# Altium schematic sheet loom-dash-box.SchDoc
size 420 x 297 mm
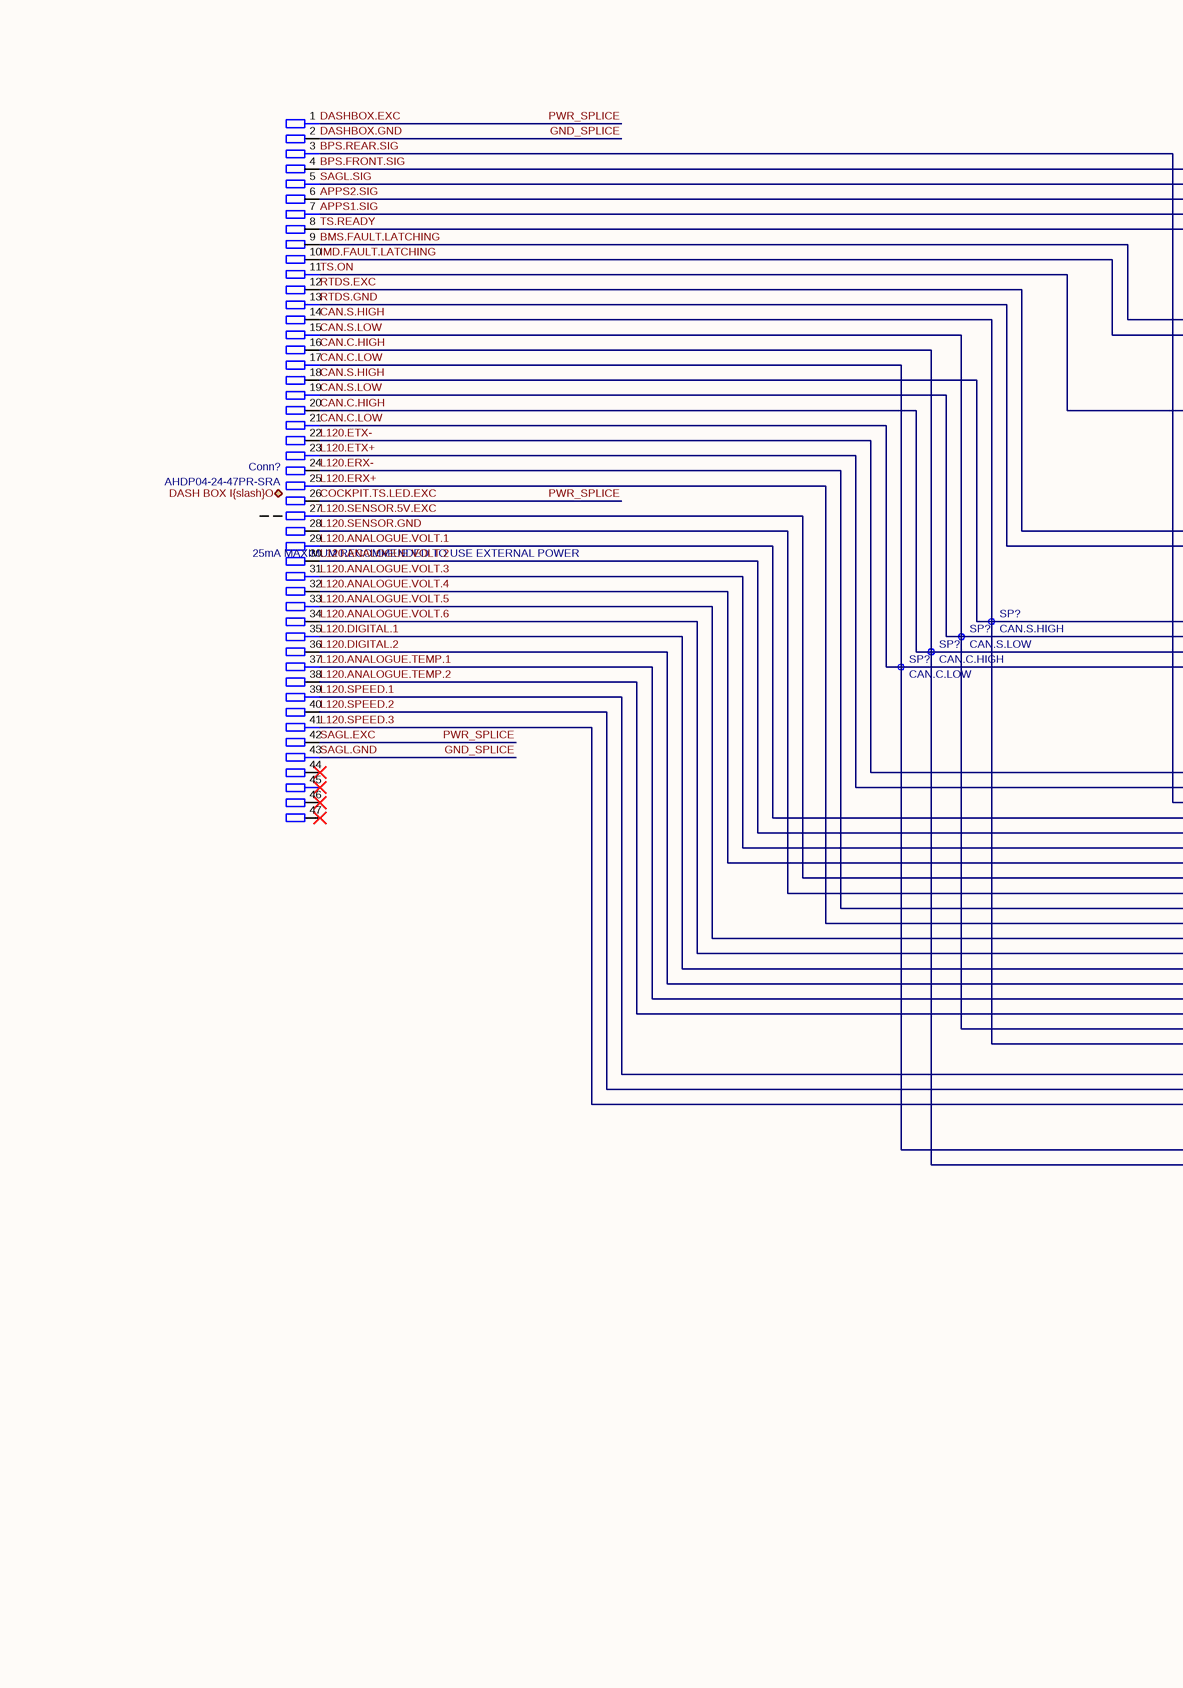
[diagram p0: loom-dash-box.SchDoc, left]
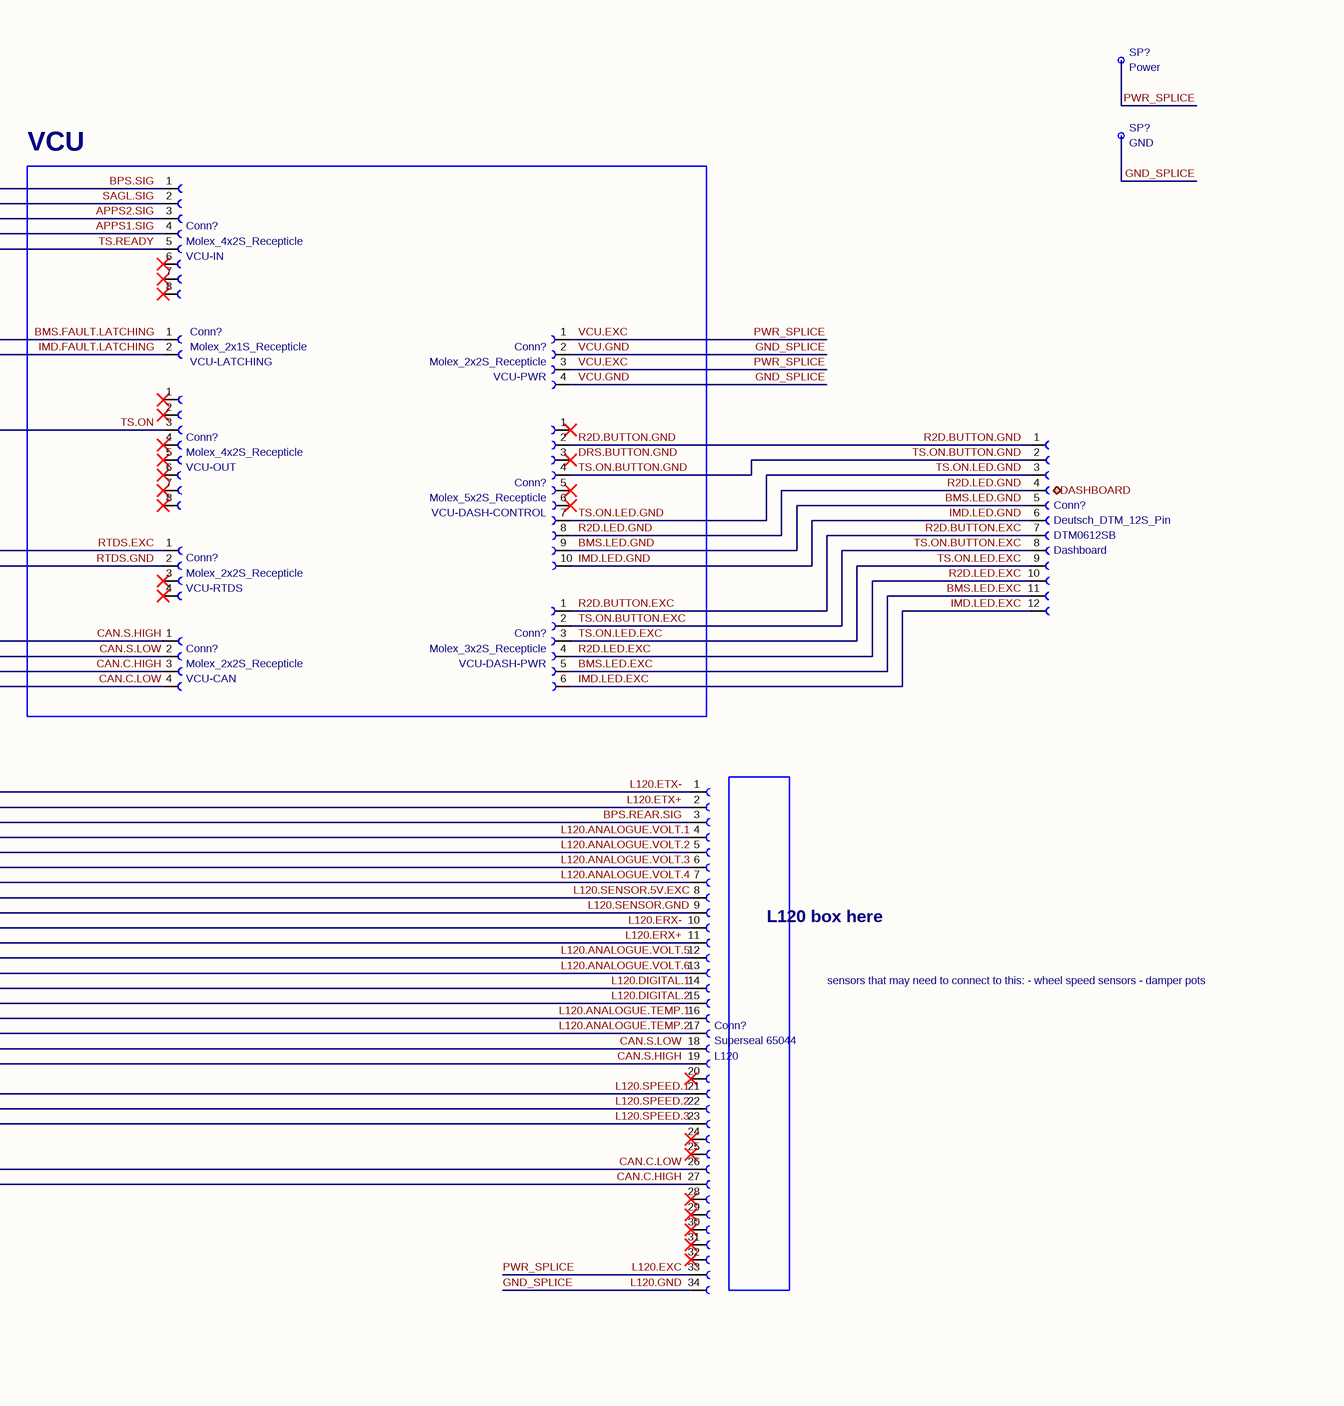
[diagram p1: loom-dash-box.SchDoc, right]

## Parts
(Parts that share a designator on the sheet are numbered #1, #2 ... from top to bottom, then left to right.)
Conn?#1  P/N: AHDP04-24-47PR-SRA  (hidden comment: AMPHENOL-47P-Pannel)
Conn?#2  Conn Name: VCU-IN  (hidden comment: Molex_4x2S_Recepticle)
Conn?#3  Conn Name: VCU-PWR  (hidden comment: Molex_2x2S_Recepticle)
Conn?#4  Conn Name: VCU-LATCHING  (hidden comment: Molex_2x1S_Recepticle)
Conn?#5  Conn Name: VCU-OUT  (hidden comment: Molex_4x2S_Recepticle)
Conn?#6  Conn Name: VCU-DASH-CONTROL  (hidden comment: Molex_5x2S_Recepticle)
Conn?#7  Conn Name: VCU-RTDS  (hidden comment: Molex_2x2S_Recepticle)
Conn?#8  Conn Name: VCU-DASH-PWR  (hidden comment: Molex_3x2S_Recepticle)
Conn?#9  Conn Name: VCU-CAN  (hidden comment: Molex_2x2S_Recepticle)
Conn?#10  P/N: DTM0612SB  Conn Name: Dashboard  (hidden comment: Deutsch_DTM_12S_Pin)
Conn?#11  P/N: Superseal 65044  Conn Name: L120  (hidden comment: L120 Connector)
SP?#1  Power
SP?#2  GND
SP?#3  CAN.S.HIGH
SP?#4  CAN.S.LOW
SP?#5  CAN.C.HIGH
SP?#6  CAN.C.LOW

## Blocks framed on the sheet
VCU: Conn?#2-Conn?#9

## Ports
DASH BOX I{slash}O (bidir), DASHBOARD (bidir)

## Nets
APPS1.SIG: Conn?#1.7 Conn?#2.4
APPS2.SIG: Conn?#1.6 Conn?#2.3
BMS.FAULT.LATCHING: Conn?#1.9 Conn?#4.1
BMS.LED.EXC: Conn?#8.5 Conn?#10.11
BMS.LED.GND: Conn?#6.9 Conn?#10.5
BPS.FRONT.SIG: Conn?#1.4 Conn?#2.1  [also labelled BPS.SIG]
BPS.REAR.SIG: Conn?#1.3 Conn?#11.3
CAN.C.HIGH: Conn?#1.16 Conn?#1.20 Conn?#9.3 Conn?#11.27 SP?#5.1
CAN.C.LOW: Conn?#1.17 Conn?#1.21 Conn?#9.4 Conn?#11.26 SP?#6.1
CAN.S.HIGH: Conn?#1.14 Conn?#1.18 Conn?#9.1 Conn?#11.19 SP?#3.1
CAN.S.LOW: Conn?#1.15 Conn?#1.19 Conn?#9.2 Conn?#11.18 SP?#4.1
COCKPIT.TS.LED.EXC: Conn?#1.1 Conn?#1.26 Conn?#1.42 Conn?#3.1 Conn?#3.3 Conn?#11.33 SP?#1.1  [also labelled DASHBOX.EXC, L120.EXC, PWR_SPLICE, SAGL.EXC, VCU.EXC]
DASHBOX.GND: Conn?#1.2 Conn?#1.43 Conn?#3.2 Conn?#3.4 Conn?#11.34 SP?#2.1  [also labelled GND_SPLICE, L120.GND, SAGL.GND, VCU.GND]
IMD.FAULT.LATCHING: Conn?#1.10 Conn?#4.2
IMD.LED.EXC: Conn?#8.6 Conn?#10.12
IMD.LED.GND: Conn?#6.10 Conn?#10.6
L120.ANALOGUE.TEMP.1: Conn?#1.37 Conn?#11.16
L120.ANALOGUE.TEMP.2: Conn?#1.38 Conn?#11.17
L120.ANALOGUE.VOLT.1: Conn?#1.29 Conn?#11.4
L120.ANALOGUE.VOLT.2: Conn?#1.30 Conn?#11.5
L120.ANALOGUE.VOLT.3: Conn?#1.31 Conn?#11.6
L120.ANALOGUE.VOLT.4: Conn?#1.32 Conn?#11.7
L120.ANALOGUE.VOLT.5: Conn?#1.33 Conn?#11.12
L120.ANALOGUE.VOLT.6: Conn?#1.34 Conn?#11.13
L120.DIGITAL.1: Conn?#1.35 Conn?#11.14
L120.DIGITAL.2: Conn?#1.36 Conn?#11.15
L120.ERX+: Conn?#1.25 Conn?#11.11
L120.ERX-: Conn?#1.24 Conn?#11.10
L120.ETX+: Conn?#1.23 Conn?#11.2
L120.ETX-: Conn?#1.22 Conn?#11.1
L120.SENSOR.5V.EXC: Conn?#1.27 Conn?#11.8
L120.SENSOR.GND: Conn?#1.28 Conn?#11.9
L120.SPEED.1: Conn?#1.39 Conn?#11.21
L120.SPEED.2: Conn?#1.40 Conn?#11.22
L120.SPEED.3: Conn?#1.41 Conn?#11.23
R2D.BUTTON.EXC: Conn?#8.1 Conn?#10.7
R2D.BUTTON.GND: Conn?#6.2 Conn?#10.1
R2D.LED.EXC: Conn?#8.4 Conn?#10.10
R2D.LED.GND: Conn?#6.8 Conn?#10.4
RTDS.EXC: Conn?#1.12 Conn?#7.1
RTDS.GND: Conn?#1.13 Conn?#7.2
SAGL.SIG: Conn?#1.5 Conn?#2.2
TS.ON: Conn?#1.11 Conn?#5.3
TS.ON.BUTTON.EXC: Conn?#8.2 Conn?#10.8
TS.ON.BUTTON.GND: Conn?#6.4 Conn?#10.2
TS.ON.LED.EXC: Conn?#8.3 Conn?#10.9
TS.ON.LED.GND: Conn?#6.7 Conn?#10.3
TS.READY: Conn?#1.8 Conn?#2.5

Not connected (* = marked no-connect by the designer): Conn?#1 44* 45* 46* 47*; Conn?#2 6* 7* 8*; Conn?#5 1* 2* 4* 5* 6* 7* 8*; Conn?#6 1* 3* 5* 6*; Conn?#7 3* 4*; Conn?#11 20* 24* 25* 28* 29* 30* 31* 32*

## Notes on the sheet
- (near Conn?#1) 25mA MAXIMUM
  RECOMMENDED
  TO USE EXTERNAL
  POWER
- L120 box here
- sensors that may need to connect to this:
  - wheel speed sensors
  - damper pots
- Labels drawn without touching a wire or pin: DRS.BUTTON.GND
- 1
- 2
- 3
- 4
- 5
- 6
- 7
- 8
- A
- B
- C
- D
- E
- Title: LOOM - DASH BOX
- File: loom-dash-box.kicad_sch
- Sheet: /
- F
- KiCad E.D.A.  kicad (5.1.4)-1
- Size: A3
- Date:
- Rev:
- Id: 1/1

## Library data of the parts
Conn?#2 Conn?#5 = Molex_4x2S_Recepticle: P/N: 43025-0800; Value: Molex_4x2S_Recepticle
Conn?#3 Conn?#7 Conn?#9 = Molex_2x2S_Recepticle: P/N: 43025-0400; Value: Molex_2x2S_Recepticle
Conn?#4 = Molex_2x1S_Recepticle: P/N: 43645-0200; Value: Molex_2x1S_Recepticle
Conn?#6 = Molex_5x2S_Recepticle: P/N: 43025-1000; Value: Molex_5x2S_Recepticle
Conn?#8 = Molex_3x2S_Recepticle: P/N: 43025-0600; Value: Molex_3x2S_Recepticle
SP?#1-SP?#6 = TestPoint_Small
  SP?#1: Value: Power
  SP?#2: Value: GND
  SP?#3: Value: CAN.S.HIGH
  SP?#4: Value: CAN.S.LOW
  SP?#5: Value: CAN.C.HIGH
  SP?#6: Value: CAN.C.LOW
Conn?#1 = AMPHENOL-47P-Pannel: Value: AMPHENOL-47P-Pannel
Conn?#10 = Deutsch_DTM_12S_Pin: Value: Deutsch_DTM_12S_Pin
Conn?#11 = L120 Connector: Value: L120 Connector